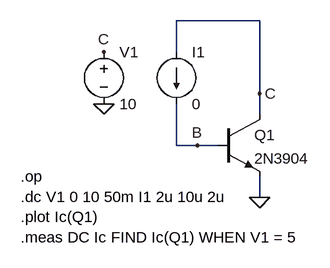
[diagram p0: schematic bjt-vce-sweep-1.asc]
bjt-vce-sweep-1.asc, the LTspice schematic file:
Version 4
SHEET 1 1780 680
WIRE 1168 -96 1040 -96
WIRE 1040 -48 1040 -96
WIRE 1168 16 1168 -96
WIRE 1168 48 1168 16
WIRE 1040 96 1040 32
WIRE 1072 96 1040 96
WIRE 1104 96 1072 96
WIRE 1168 176 1168 144
FLAG 1168 176 0
FLAG 1072 96 B
FLAG 1168 16 C
FLAG 928 -48 C
FLAG 928 32 0
SYMBOL npn 1104 48 R0
SYMATTR InstName Q1
SYMATTR Value 2N3904
SYMBOL current 1040 -48 R0
SYMATTR InstName I1
SYMATTR Value 0
SYMBOL voltage 928 -64 R0
SYMATTR InstName V1
SYMATTR Value 10
TEXT 800 144 Left 2 !.op\n.dc V1 0 10 50m I1 2u 10u 2u\n.plot Ic(Q1)\n.meas DC Ic FIND Ic(Q1) WHEN V1 = 5

The netlist it stands for:
* bjt-vce-sweep-1.asc
Q1 C B 0 0 2N3904
I1 C B 0
V1 C 0 10
.model NPN NPN
.model PNP PNP
.lib standard.bjt
.op
.dc V1 0 10 50m I1 2u 10u 2u
.plot Ic(Q1)
.meas DC Ic FIND Ic(Q1) WHEN V1 = 5
.backanno
.end

* Results of the author's LTspice run, read from the files saved beside the schematic
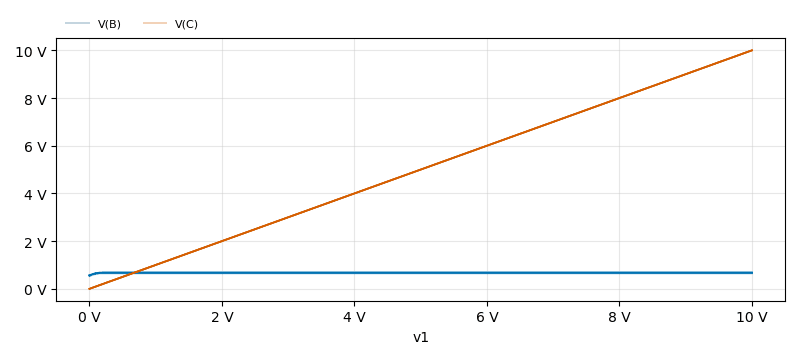
[diagram p1: DC transfer characteristic of bjt-vce-sweep-1.asc, plotted from the saved traces]
* DC transfer characteristic, 5 runs:
*   V(B) [i1=2e-06]: 529.9 mV at v1=0 V, 642 mV at v1=10 V, min 529.9 mV, max 642.2 mV
*   V(B) [i1=4e-06]: 547.9 mV at v1=0 V, 660 mV at v1=10 V, min 547.9 mV, max 660.2 mV
*   V(B) [i1=6e-06]: 558.4 mV at v1=0 V, 670.6 mV at v1=10 V, min 558.4 mV, max 670.8 mV
*   V(B) [i1=8e-06]: 565.9 mV at v1=0 V, 678.2 mV at v1=10 V, min 565.9 mV, max 678.4 mV
*   V(B) [i1=1e-05]: 571.7 mV at v1=0 V, 684.1 mV at v1=10 V, min 571.7 mV, max 684.2 mV
*   V(C) [i1=2e-06]: 0 V at v1=0 V, 10 V at v1=10 V, min 0 V, max 10 V
*   V(C) [i1=4e-06]: 0 V at v1=0 V, 10 V at v1=10 V, min 0 V, max 10 V
*   V(C) [i1=6e-06]: 0 V at v1=0 V, 10 V at v1=10 V, min 0 V, max 10 V
*   V(C) [i1=8e-06]: 0 V at v1=0 V, 10 V at v1=10 V, min 0 V, max 10 V
*   V(C) [i1=1e-05]: 0 V at v1=0 V, 10 V at v1=10 V, min 0 V, max 10 V
* From the log:
*   Measurement: ic
*     step  ic(q1)  at
*        1  0.000625213  5
*        2  0.00124835  5
*        3  0.00186955  5
*        4  0.00248888  5
*        5  0.00310635  5